# Altium schematic sheet Filter Capacitors - Port L.SchDoc: PORT L Filter Capacitors
size A4; DocumentNumber: 32; SheetNumber: 32; SheetTotal: 54
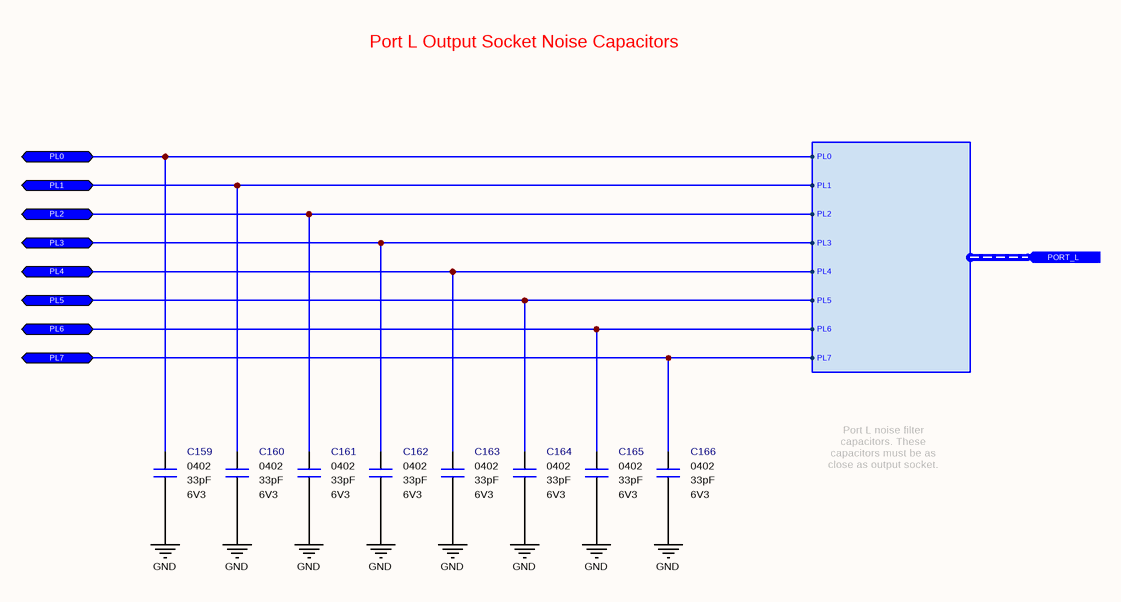
[diagram p0: Filter Capacitors - Port L.SchDoc]

## Parts
C159  value 33pF  Case: 0402  Voltage: 6V3  [CAPACITOR_0402]  (hidden comment: Multilayer Ceramic Capacitor)
C160  value 33pF  Case: 0402  Voltage: 6V3  [CAPACITOR_0402]  (hidden comment: Multilayer Ceramic Capacitor)
C161  value 33pF  Case: 0402  Voltage: 6V3  [CAPACITOR_0402]  (hidden comment: Multilayer Ceramic Capacitor)
C162  value 33pF  Case: 0402  Voltage: 6V3  [CAPACITOR_0402]  (hidden comment: Multilayer Ceramic Capacitor)
C163  value 33pF  Case: 0402  Voltage: 6V3  [CAPACITOR_0402]  (hidden comment: Multilayer Ceramic Capacitor)
C164  value 33pF  Case: 0402  Voltage: 6V3  [CAPACITOR_0402]  (hidden comment: Multilayer Ceramic Capacitor)
C165  value 33pF  Case: 0402  Voltage: 6V3  [CAPACITOR_0402]  (hidden comment: Multilayer Ceramic Capacitor)
C166  value 33pF  Case: 0402  Voltage: 6V3  [CAPACITOR_0402]  (hidden comment: Multilayer Ceramic Capacitor)

## Ports
PL0 (bidir), PL1 (bidir), PL2 (bidir), PL3 (bidir), PL4 (bidir), PL5 (bidir), PL6 (bidir), PL7 (bidir), PORT_L (in, harness PORT_L)

## Harnesses
PORT_L: PL0, PL1, PL2, PL3, PL4, PL5, PL7, PL6

## Nets
GND: C159.1 C160.1 C161.1 C162.1 C163.1 C164.1 C165.1 C166.1
PL0: C159.2 ; port PL0, port PORT_L.PL0
PL1: C160.2 ; port PL1, port PORT_L.PL1
PL2: C161.2 ; port PL2, port PORT_L.PL2
PL3: C162.2 ; port PL3, port PORT_L.PL3
PL4: C163.2 ; port PL4, port PORT_L.PL4
PL5: C164.2 ; port PL5, port PORT_L.PL5
PL6: C165.2 ; port PL6, port PORT_L.PL6
PL7: C166.2 ; port PL7, port PORT_L.PL7

## Notes on the sheet
- Port L Output Socket Noise Capacitors
- Port L noise filter capacitors. These capacitors must be as close as output socket.
- Engineer
- All Rights are reserved to Customer and Engineer. [2021]
- Size:
- Date:
- A4
- Project :
- Time:
- Sheet
- of
- Customer
- Product ID
- Module ID
- Version
- File:
- Revision

## Library data of the parts
C159-C166 = Capacitor - 33pF [0402-6V3]: Capacitor - 33pF [0402] (Ceramic); Manufacturer Name: Kemet; Manufacturer Part Number: C0402C330J9RACAUTO; Dielectric: X7R; Tolerance: 10%; Height: 0.5mm; Maximum Operating Temperature: +125; Minimum Operating Temperature: -55; ROHS: Yes; ComponentLink1Description: DataSheet; ComponentLink1URL: https://api.kemet.com/component-edge/download/datasheet/C0402C330J9RACAUTO.pdf; ComponentLink2Description: Mouser; ComponentLink2URL: https://www.mouser.com/Search/Refine.aspx?Keyword=80-C0402C330J9RAUTO; Supplier 1: Mouser; Supplier Part Number 1: 80-C0402C330J9RAUTO; Mouser Part Number: 80-C0402C330J9RAUTO